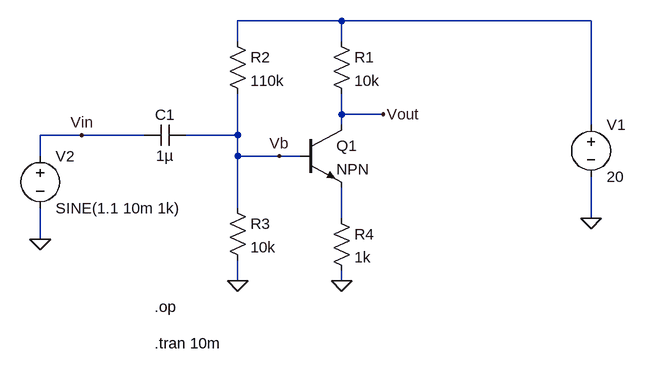
[diagram p0: schematic common_emitter.asc]
common_emitter.asc, the LTspice schematic file:
Version 4
SHEET 1 880 680
WIRE 320 -48 160 -48
WIRE 704 -48 320 -48
WIRE 160 -16 160 -48
WIRE 320 -16 320 -48
WIRE 320 96 320 64
WIRE 384 96 320 96
WIRE 320 112 320 96
WIRE 704 112 704 -48
WIRE -80 128 -144 128
WIRE 16 128 -80 128
WIRE 160 128 160 64
WIRE 160 128 80 128
WIRE -144 160 -144 128
WIRE 160 160 160 128
WIRE 224 160 160 160
WIRE 256 160 224 160
WIRE 160 240 160 160
WIRE 320 256 320 208
WIRE 704 256 704 192
WIRE -144 288 -144 240
WIRE 160 352 160 320
WIRE 320 352 320 336
FLAG -144 288 0
FLAG 320 352 0
FLAG 704 256 0
FLAG 384 96 Vout
FLAG 160 352 0
FLAG -80 128 Vin
FLAG 224 160 Vb
SYMBOL res 304 240 R0
SYMATTR InstName R4
SYMATTR Value 1k
SYMBOL voltage 704 96 R0
WINDOW 123 0 0 Left 0
WINDOW 39 0 0 Left 0
SYMATTR InstName V1
SYMATTR Value 20
SYMBOL npn 256 112 R0
SYMATTR InstName Q1
SYMBOL voltage -144 144 R0
WINDOW 123 0 0 Left 0
WINDOW 39 24 124 Left 2
SYMATTR InstName V2
SYMATTR Value SINE(1.1 10m 1k)
SYMBOL res 304 -32 R0
SYMATTR InstName R1
SYMATTR Value 10k
SYMBOL res 144 -32 R0
SYMATTR InstName R2
SYMATTR Value 110k
SYMBOL res 144 224 R0
SYMATTR InstName R3
SYMATTR Value 10k
SYMBOL cap 80 112 R90
WINDOW 0 0 32 VBottom 2
WINDOW 3 32 32 VTop 2
SYMATTR InstName C1
SYMATTR Value 1µ
TEXT 32 392 Left 2 !.op
TEXT 32 448 Left 2 !.tran 10m

The netlist it stands for:
* common_emitter.asc
R4 N002 0 1k
V1 N001 0 20
Q1 Vout Vb N002 0 NPN
V2 Vin 0 SINE(1.1 10m 1k)
R1 N001 Vout 10k
R2 N001 Vb 110k
R3 Vb 0 10k
C1 Vb Vin 1µ
.model NPN NPN
.model PNP PNP
.lib standard.bjt
.op
.tran 10m
.backanno
.end